# Altium schematic sheet Wireless power_inverter.SchDoc
size A4
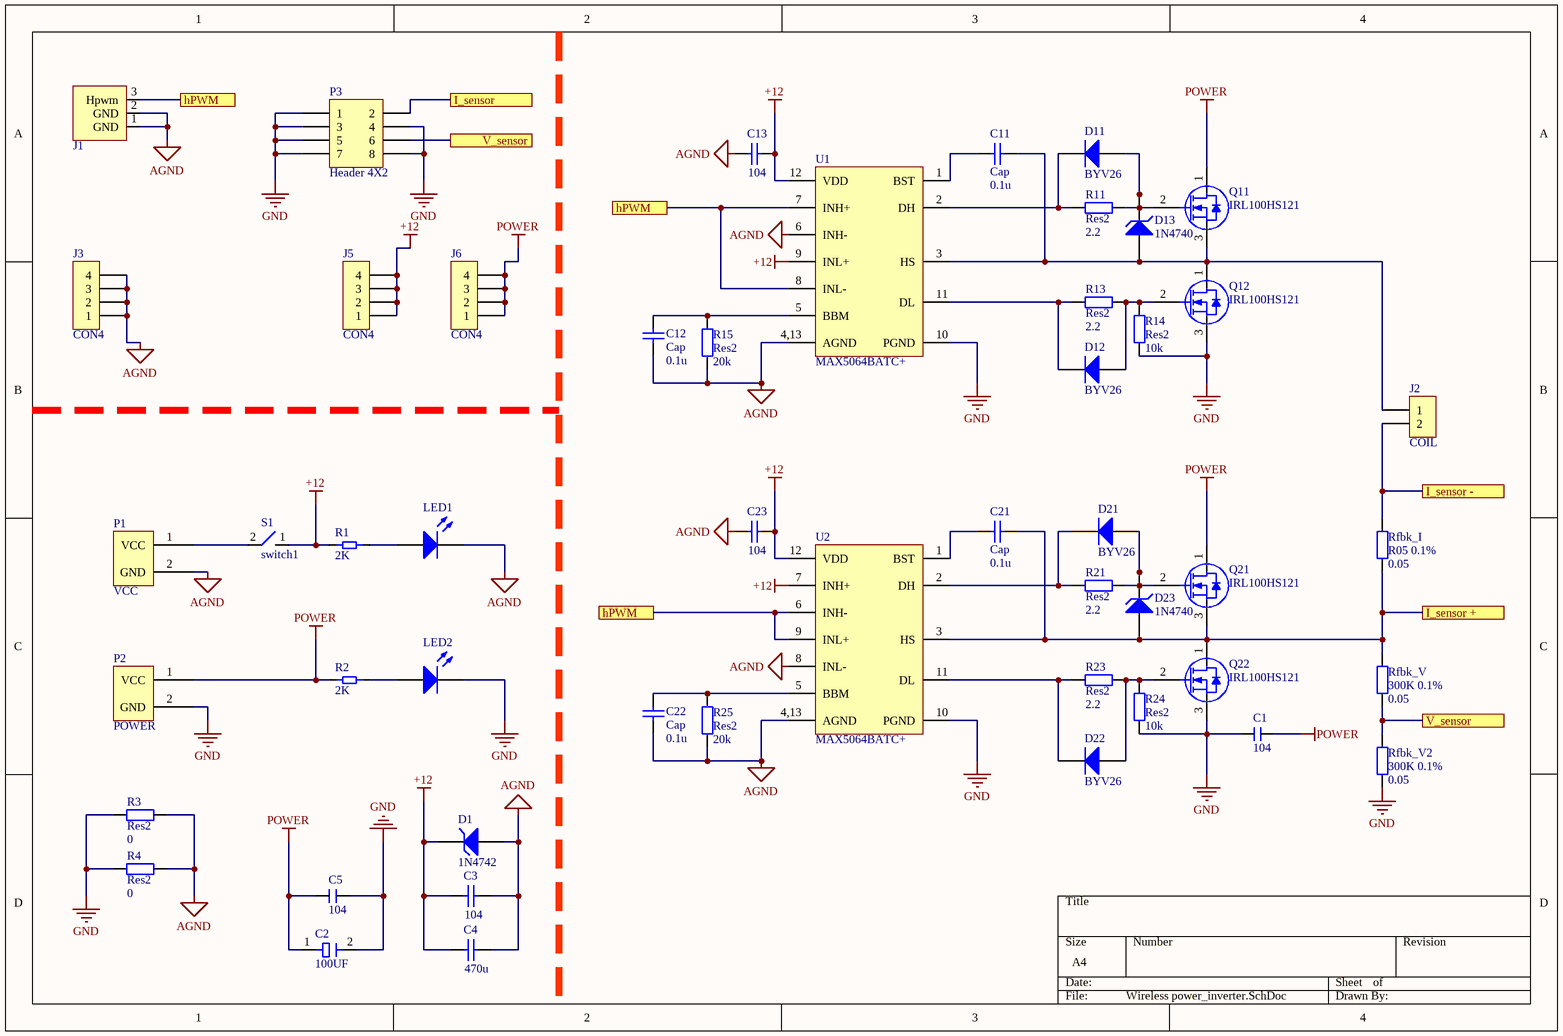
[diagram p0: Wireless power_inverter.SchDoc]

## Parts
C1  104  [1210]
C2  100UF  [CE/10MM]
C3  value 104  [0805C]  (hidden comment: Cap)
C4  value 470u  [CD6]  (hidden comment: Cap)
C5  104  [1210]
C11  Cap  value 0.1u  [1206]
C12  Cap  value 0.1u  [0805C]
C13  value 104  [0805C]  (hidden comment: Cap)
C21  Cap  value 0.1u  [1206]
C22  Cap  value 0.1u  [0805C]
C23  value 104  [0805C]  (hidden comment: Cap)
D1  1N4742  [1N4148_Stand]
D11  BYV26  [1N4148_Stand]
D12  BYV26  [1N4148_Stand]
D13  1N4740  [1N4148_Stand]
D21  BYV26  [1N4148_Stand]
D22  BYV26  [1N4148_Stand]
D23  1N4740  [1N4148_Stand]
J1  PORT  [SIP3]  (value not drawn)
J2  COIL  [COIL]
J3  CON4  [SIP4]
J5  CON4  [SIP4]
J6  CON4  [SIP4]
LED1  (no value)  [0603_LED]
LED2  (no value)  [0603_LED]
P1  VCC  [050-2]
P2  POWER  [050-2]
P3  Header 4X2  [HDR2X4]
Q11  IRL100HS121  [mixmos]
Q12  IRL100HS121  [mixmos]
Q21  IRL100HS121  [mixmos]
Q22  IRL100HS121  [mixmos]
R1  2K  [0603-R]
R2  2K  [0603-R]
R3  Res2  value 0  [1206R]
R4  Res2  value 0  [1206R]
R11  Res2  value 2.2  [0805R]
R13  Res2  value 2.2  [0805R]
R14  Res2  value 10k  [AXIAL0.1Z]
R15  Res2  value 20k  [AXIAL0.1Z]
R21  Res2  value 2.2  [0805R]
R23  Res2  value 2.2  [0805R]
R24  Res2  value 10k  [AXIAL0.1Z]
R25  Res2  value 20k  [AXIAL0.1Z]
Rfbk_I  R05 0.1%  value 0.05  [AXIAL0.7]
Rfbk_V  300K 0.1%  value 0.05  [AXIAL0.3]
Rfbk_V2  300K 0.1%  value 0.05  [AXIAL0.3]
S1  switch1  [Switch_8.2*5.2]
U1  MAX5064BATC+  [QFN80P400X400X100_HS-13M]
U2  MAX5064BATC+  [QFN80P400X400X100_HS-13M]

## Ports
hPWM, I_sensor, I_sensor +, I_sensor -, V_sensor

## Nets
+12: C3.1 C4.1 C13.2 C23.2 D1.2(K) J5.1 J5.2 J5.3 J5.4 R1.2 S1.1 U1.9(INL+) U1.12(VDD) U2.7(INH+) U2.12(VDD)
AGND: C3.2 C4.2 C12.1 C13.1 C22.1 C23.1 D1.1(A) J1.1(GND) J1.2(GND) J3.1 J3.2 J3.3 J3.4 LED1.2(K) P1.2(GND) R3.2 R4.2 R15.1 R25.1 U1.4,13(AGND) U1.6(INH-) U2.4,13(AGND) U2.8(INL-)
GND: C1.1 C2.2 C5.2 LED2.2(K) P2.2(GND) P3.1 P3.3 P3.4 P3.5 P3.7 P3.8 Q12.3(S) Q22.3(S) R3.1 R4.1 R14.1 R24.1 Rfbk_V2.1 U1.10(PGND) U2.10(PGND)
POWER: C1.2 C2.1 C5.1 J6.1 J6.2 J6.3 J6.4 P2.1(VCC) Q11.1(D) Q21.1(D) R2.2
hPWM: J1.3(Hpwm) U1.7(INH+) U1.8(INL-) U2.6(INH-) U2.9(INL+) ; port hPWM
I_sensor: P3.2 ; port I_sensor
I_sensor +: C21.2 D23.1(A) Q21.3(S) Q22.1(D) Rfbk_I.2 Rfbk_V.2 U2.3(HS) ; port I_sensor +
I_sensor -: J2.2 Rfbk_I.1 ; port I_sensor -
V_sensor: P3.6 Rfbk_V.1 Rfbk_V2.2 ; port V_sensor
NetC11_1: C11.1 U1.1(BST)
NetC11_2: C11.2 D13.1(A) J2.1 Q11.3(S) Q12.1(D) U1.3(HS)
NetC12_2: C12.2 R15.2 U1.5(BBM)
NetC21_1: C21.1 U2.1(BST)
NetC22_2: C22.2 R25.2 U2.5(BBM)
NetD11_1: D11.1(A) D13.2(K) Q11.2(G) R11.2
NetD11_2: D11.2(K) R11.1 U1.2(DH)
NetD12_1: D12.1(A) Q12.2(G) R13.2 R14.2
NetD12_2: D12.2(K) R13.1 U1.11(DL)
NetD21_1: D21.1(A) D23.2(K) Q21.2(G) R21.2
NetD21_2: D21.2(K) R21.1 U2.2(DH)
NetD22_1: D22.1(A) Q22.2(G) R23.2 R24.2
NetD22_2: D22.2(K) R23.1 U2.11(DL)
NetLED1_1: LED1.1(A) R1.1
NetLED2_1: LED2.1(A) R2.1
NetP1_1: P1.1(VCC) S1.2

## Library data of the parts
C1 C5 = CBB
C2 = ELECTRO1: 电解电容
C3 C4 C11-C13 C21-C23 = Cap: Capacitor; Published: 8-Jun-2000; LatestRevisionDate: 17-Jul-2002; LatestRevisionNote: Re-released for DXP Platform.; PackageReference: RAD-0.3; Publisher: Altium Limited; PackageDescription: Radial Cap, Thru-Hole; 2 Leads; 0.3 in Pin Spacing
D1 D13 D23 = D Zener: Zener Diode; Published: 8-Jun-2000; LatestRevisionDate: 17-Jul-2002; LatestRevisionNote: Re-released for DXP Platform.; PackageReference: DIODE-0.7; Publisher: Altium Limited; PackageDescription: Diode, Thru-Hole; 2 Leads; 0.7 in Pin Spacing
D11 D12 D21 D22 = Diode 1N4007: 1 Amp General Purpose Rectifier; Published: 8-Jun-2000; LatestRevisionDate: 17-Jul-2002; LatestRevisionNote: Re-released for DXP Platform.; DatasheetVersion: 1998; PackageVersion: Aug-1999; PackageReference: DO-41; Publisher: Altium Limited; PackageDescription: Diode, Axial; Body 5.2 x 2.7 mm (LxDia. max), Lead Dia. 0.86 mm (max); Code_JEDEC: DO-204-AL; ComponentLink1Description: Manufacturer Link; ComponentLink1URL: http://www.fairchildsemi.com/; ComponentLink2Description: Datasheet; ComponentLink2URL: http://www.fairchildsemi.com/ds/1N%2F1N4001.pdf
J2 = CON2: Connector
J3 J5 J6 = CON4: Connector
LED1 LED2 = LED2: Typical RED, GREEN, YELLOW, AMBER GaAs LED; Published: 8-Jun-2000; LatestRevisionDate: 17-Jul-2002; LatestRevisionNote: Re-released for DXP Platform.; PackageVersion: Feb-2002; PackageReference: 3.2X1.6X1.1; Publisher: Altium Limited; PackageDescription: SM LED; 2 Flat Leads
P1 = POWER
P3 = Header 4X2: Header, 4-Pin, Dual row; LatestRevisionDate: 17-Jul-2002; LatestRevisionNote: Re-released for DXP Platform.; Publisher: Altium Limited
R1 R2 = RES
R3 R4 R11 R13-R15 R21 R23-R25 Rfbk_I Rfbk_V Rfbk_V2 = Res2: Resistor; Published: 8-Jun-2000; LatestRevisionDate: 17-Jul-2002; LatestRevisionNote: Re-released for DXP Platform.; PackageReference: AXIAL-0.4; Publisher: Altium Limited; PackageDescription: Axial Device, Thru-Hole; 2 Leads; 0.4 in Pin Spacing
U1 U2 = MAX5064BATC+: pin to pad: 4,13>4